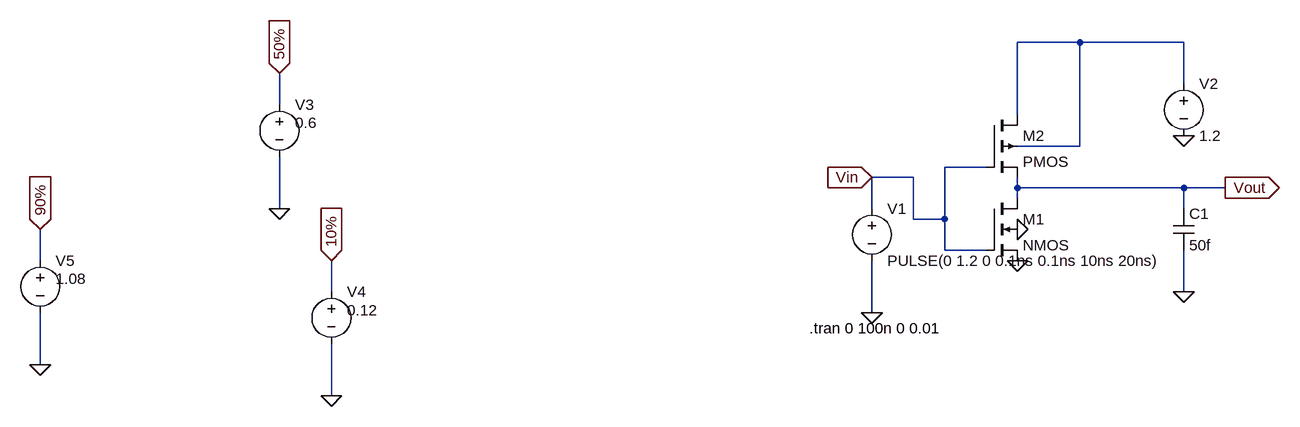
[diagram p0: schematic 90_inverter transisent.asc]
90_inverter transisent.asc, the LTspice schematic file:
Version 4.1
SHEET 1 1280 680
WIRE 944 -80 848 -80
WIRE 1104 -80 944 -80
WIRE 1104 -16 1104 -80
WIRE -288 16 -288 -32
WIRE 848 32 848 -80
WIRE 944 80 944 -80
WIRE 944 80 848 80
WIRE 800 112 736 112
WIRE 688 128 624 128
WIRE 848 144 848 128
WIRE 1104 144 848 144
WIRE 1168 144 1104 144
WIRE 848 160 848 144
WIRE -288 176 -288 96
WIRE 624 176 624 128
WIRE 1104 176 1104 144
WIRE 688 192 688 128
WIRE 736 192 736 112
WIRE 736 192 688 192
WIRE 736 240 736 192
WIRE 800 240 736 240
WIRE -656 256 -656 208
WIRE -208 304 -208 256
WIRE 1104 304 1104 240
WIRE 624 336 624 256
WIRE -656 416 -656 336
WIRE -208 464 -208 384
FLAG 624 336 0
FLAG 1104 64 0
FLAG 848 256 0
FLAG 848 208 0
FLAG 1104 304 0
FLAG 624 128 Vin
IOPIN 624 128 In
FLAG 1168 144 Vout
IOPIN 1168 144 Out
FLAG -288 176 0
FLAG -288 -32 50%
IOPIN -288 -32 In
FLAG -208 464 0
FLAG -208 256 10%
IOPIN -208 256 In
FLAG -656 416 0
FLAG -656 208 90%
IOPIN -656 208 In
SYMBOL nmos4 800 160 R0
SYMATTR InstName M1
SYMATTR Value2 l=90nm w=135nm
SYMBOL pmos4 800 32 R0
SYMATTR InstName M2
SYMATTR Value2 l=90nm w=405nm
SYMBOL cap 1088 176 R0
SYMATTR InstName C1
SYMATTR Value 50f
SYMBOL voltage 624 160 R0
WINDOW 123 0 0 Left 0
WINDOW 39 0 0 Left 0
SYMATTR InstName V1
SYMATTR Value PULSE(0 1.2 0 0.1ns 0.1ns 10ns 20ns)
SYMBOL voltage 1104 -32 R0
WINDOW 123 0 0 Left 0
WINDOW 39 0 0 Left 0
SYMATTR InstName V2
SYMATTR Value 1.2
SYMBOL voltage -288 0 R0
WINDOW 123 0 0 Left 0
WINDOW 39 0 0 Left 0
WINDOW 3 24 44 Left 2
SYMATTR Value 0.6
SYMATTR InstName V3
SYMBOL voltage -208 288 R0
WINDOW 123 0 0 Left 0
WINDOW 39 0 0 Left 0
WINDOW 3 24 44 Left 2
SYMATTR Value 0.12
SYMATTR InstName V4
SYMBOL voltage -656 240 R0
WINDOW 123 0 0 Left 0
WINDOW 39 0 0 Left 0
WINDOW 3 24 44 Left 2
SYMATTR Value 1.08
SYMATTR InstName V5
TEXT 528 360 Left 2 !.tran 0 100n 0 0.01

The netlist it stands for:
* 90_inverter transisent.asc
M1 Vout Vin 0 0 NMOS l=90nm w=135nm
M2 N001 Vin Vout N001 PMOS l=90nm w=405nm
C1 Vout 0 50f
V1 Vin 0 PULSE(0 1.2 0 0.1ns 0.1ns 10ns 20ns)
V2 N001 0 1.2
V3 50% 0 0.6
V4 10% 0 0.12
V5 90% 0 1.08
.model NMOS NMOS
.model PMOS PMOS
.lib standard.mos
.tran 0 100n 0 0.01
.backanno
.end